# EAGLE design ioh-landscape (EAGLE 6.5.0)
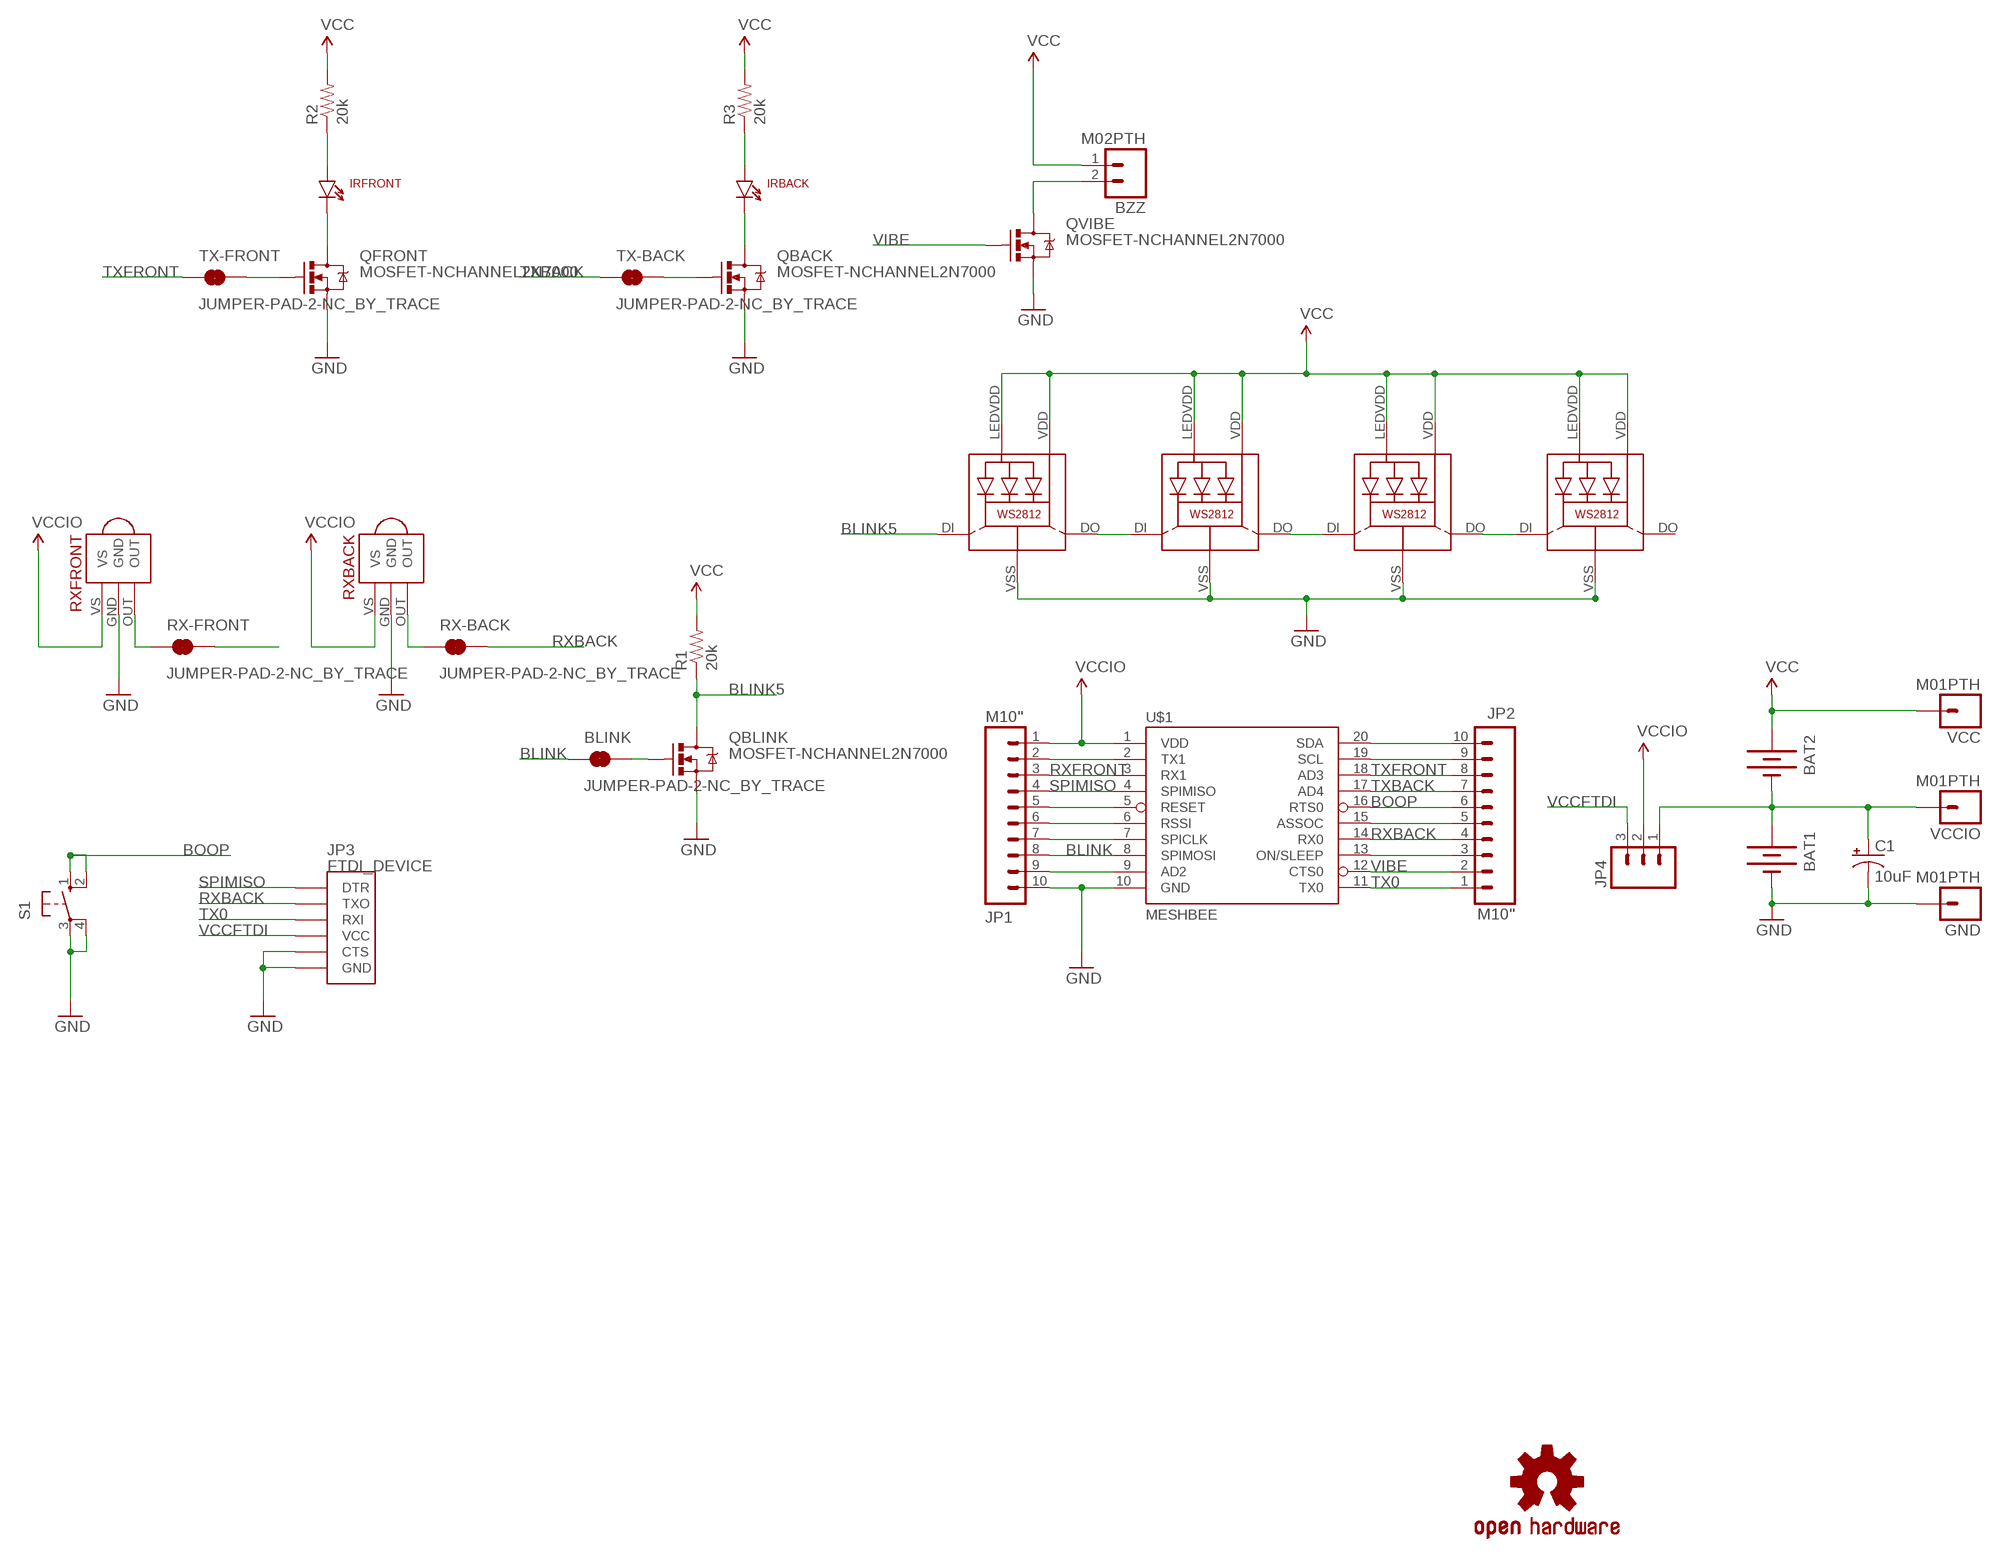
[diagram p0: schematic, sheet 1]

## Parts
BAT1  BATTERY20PTH  [BATTCOM_20MM_PTH]
BAT2  BATTERY20PTH  [BATTCOM_20MM_PTH]
BLINK  JUMPER-PAD-2-NC_BY_TRACE  [PAD-JUMPER-2-NC_BY_TRACE_YES_SILK]
BZZ  M02PTH  [1X02]
C1  10uF  10UF-25V-20%(PTH)KIT  [CPOL-RADIAL-10UF-25V-KIT]
GND  M01PTH  [1X01]
IRBACK  LTE-302  [LTE-302]
IRFRONT  LTE-302  [LTE-302]
JP1  M10"  [1X10]
JP2  M10"  [1X10]
JP3  FTDI_DEVICE  [FTDI_DEVICE_SIDE]
JP4  M03LOCK  [1X03_LOCK]
LED2  WS2812  [WS2812]
LED3  WS2812  [WS2812]
LED4  WS2812  [WS2812]
LED5  WS2812  [WS2812]
LOGO1  OSHW-LOGOS  [OSHW-LOGO-S]
QBACK  MOSFET-NCHANNEL2N7000  [TO-92]
QBLINK  MOSFET-NCHANNEL2N7000  [TO-92]
QFRONT  MOSFET-NCHANNEL2N7000  [TO-92]
QVIBE  MOSFET-NCHANNEL2N7000  [TO-92]
R1  20k  RESISTORPTH-1/4W  [AXIAL-0.4]
R2  20k  RESISTORPTH-1/4W  [AXIAL-0.4]
R3  20k  RESISTORPTH-1/4W  [AXIAL-0.4]
RX-BACK  JUMPER-PAD-2-NC_BY_TRACE  [PAD-JUMPER-2-NC_BY_TRACE_YES_SILK]
RX-FRONT  JUMPER-PAD-2-NC_BY_TRACE  [PAD-JUMPER-2-NC_BY_TRACE_YES_SILK]
RXBACK  TSOP2438  [TSOP2438]
RXFRONT  TSOP2438  [TSOP2438]
S1  40-XX  [B3F-40XX]
TX-BACK  JUMPER-PAD-2-NC_BY_TRACE  [PAD-JUMPER-2-NC_BY_TRACE_YES_SILK]
TX-FRONT  JUMPER-PAD-2-NC_BY_TRACE  [PAD-JUMPER-2-NC_BY_TRACE_YES_SILK]
U$1  MESHBEE  [MESHBEE]
VCC  M01PTH  [1X01]
VCCIO  M01PTH  [1X01]

## Nets
BLINK: BLINK.1 JP1.8 U$1.8(SPIMOSI)
BLINK5: LED2.DI QBLINK.3(D) R1.P$1
BOOP: JP2.6 S1.1(S) S1.2(S1) U$1.16(RTS0)
GND: BAT1.2(-) C1.2(-) GND.1 JP1.10 JP3.P$5(CTS) JP3.P$6(GND) LED2.VSS(GND) LED3.VSS(GND) LED4.VSS(GND) LED5.VSS(GND) QBACK.1(S) QBLINK.1(S) QFRONT.1(S) QVIBE.1(S) RXBACK.GND RXFRONT.GND S1.3(P) S1.4(P1) U$1.10(GND)
N$1: LED2.DO LED3.DI
N$2: LED3.DO LED4.DI
N$3: LED4.DO LED5.DI
N$4: IRFRONT.A R2.P$1
N$5: JP1.2 U$1.2(TX1)
N$6: BLINK.2 QBLINK.2(G)
N$8: JP1.5 U$1.5(RESET)
N$9: JP1.6 U$1.6(RSSI)
N$10: JP1.7 U$1.7(SPICLK)
N$11: IRFRONT.C QFRONT.3(D)
N$12: JP1.9 U$1.9(AD2)
N$13: BZZ.2 QVIBE.3(D)
N$14: BAT1.1(+) BAT2.2(-) C1.1(+) JP4.1 VCCIO.1
N$15: RX-BACK.1 RXBACK.OUT
N$16: JP2.3 U$1.13(ON/SLEEP)
N$17: RX-FRONT.1 RXFRONT.OUT
N$18: JP2.5 U$1.15(ASSOC)
N$20: QFRONT.2(G) TX-FRONT.2
N$21: QBACK.2(G) TX-BACK.2
N$22: JP2.9 U$1.19(SCL)
N$23: JP2.10 U$1.20(SDA)
N$24: IRBACK.A R3.P$1
N$25: IRBACK.C QBACK.3(D)
RXBACK: JP2.4 JP3.P$2(TXO) RX-BACK.2 U$1.14(RX0)
RXFRONT: JP1.3 RX-FRONT.2 U$1.3(RX1)
SPIMISO: JP1.4 JP3.P$1(DTR) U$1.4(SPIMISO)
TX0: JP2.1 JP3.P$3(RXI) U$1.11(TX0)
TXBACK: JP2.7 TX-BACK.1 U$1.17(AD4)
TXFRONT: JP2.8 TX-FRONT.1 U$1.18(AD3)
VCC: BAT2.1(+) BZZ.1 LED2.LEDVDD LED2.VDD LED3.LEDVDD LED3.VDD LED4.LEDVDD LED4.VDD LED5.LEDVDD LED5.VDD R1.P$2 R2.P$2 R3.P$2 VCC.1
VCCFTDI: JP3.P$4(VCC) JP4.3
VCCIO: JP1.1 JP4.2 RXBACK.VS RXFRONT.VS U$1.1(VDD)
VIBE: JP2.2 QVIBE.2(G) U$1.12(CTS0)
Unconnected: LED5.DO

## Library data of the parts
BAT1 BAT2 = SparkFun-Electromechanical:BATTERY: Battery Holders Various common sizes : AA, AAA, 20mm coin cell and 12mm coin cell. 20MM_4LEGS, BATT-10373
BLINK RX-BACK RX-FRONT TX-BACK TX-FRONT = SparkFun-Passives:JUMPER-PAD-2-NC_BY_TRACE
BZZ = SparkFun-Connectors:M02: Standard 2-pin 0.1" header. Use with - straight break away headers ( PRT-00116) - right angle break away headers (PRT-00553) - swiss pins (PRT-00743) - machine pins (PRT-00117) - female headers (PRT-00115) Molex polarized connector foot print use with: PRT-08233 with associated crimp pins and housings. 2.54_SCREWTERM for use with PRT-10571. 3.5mm Screw Terminal footprints for PRT-08084 5mm Screw Terminal footprints for use with PRT-08432
C1 = SparkFun-Capacitors:10UF-25V-20%(PTH): CAP-08440; PROD_ID: CAP-08440
GND VCC VCCIO = SparkFun-Connectors:M01: Header 1 Standard 1-pin 0.1" header. Use with straight break away headers (SKU : PRT-00116), right angle break away headers (PRT-00553), swiss pins (PRT-00743), machine pins (PRT-00117), and female headers (PRT-00115).
IRBACK IRFRONT = SparkFun-LED:LTE-302: Through-hole side-firing 940nm IR LED
JP1 JP2 = SparkFun-Connectors:M10: Header 10 Standard 10-pin 0.1" header. Use with straight break away headers (SKU : PRT-00116), right angle break away headers (PRT-00553), swiss pins (PRT-00743), machine pins (PRT-00117), and female headers (PRT-00115).
JP3 = SparkFun-Connectors:FTDI_DEVICE: Connector which mates to FTDI basic or FTDI cable.
JP4 = SparkFun-Connectors:M03: Header 3 Standard 3-pin 0.1" header. Use with straight break away headers (SKU : PRT-00116), right angle break away headers (PRT-00553), swiss pins (PRT-00743), machine pins (PRT-00117), and female headers (PRT-00115). Molex polarized connector foot print use with SKU : PRT-08232 with associated crimp pins and housings.
LED2-LED5 = adafruit:WS2812
LOGO1 = SparkFun-Aesthetics:OSHW-LOGO: Open Source Hardware Logo This logo indicates the piece of hardware it is found on incorporates a OSHW license and/or adheres to the definition of open source hardware found here: http://freedomdefined.org/OSHW
QBACK QBLINK QFRONT QVIBE = SparkFun-DiscreteSemi:MOSFET-NCHANNEL: Common NMOSFET Parts MFG P/N Store ID Prod ID FDD8780 TRANS-09984 SI7820DN TRANS-11055 FDS6630A IC-08089 2N7002PW TRANS-11151 FQP30N06L COM-10213 TRANS-10060 BSS123LT1G TRANS-08345 BSS138 TRANS-00830 BS170 2N7000
R1-R3 = SparkFun-Resistors:RESISTOR: Resistor Basic schematic elements and footprints for 0603, 1206, and PTH resistors.
RXBACK RXFRONT = ioh-1:TSOP2438
S1 = adafruit:40-XX: OMRON SWITCH; MF: OMRON COMPONENTS USA; MPN: B3F-4000; OC_FARNELL: 176434; OC_NEWARK: 36K3105
U$1 = ioh-1:MESHBEE: meshbee module

## Board
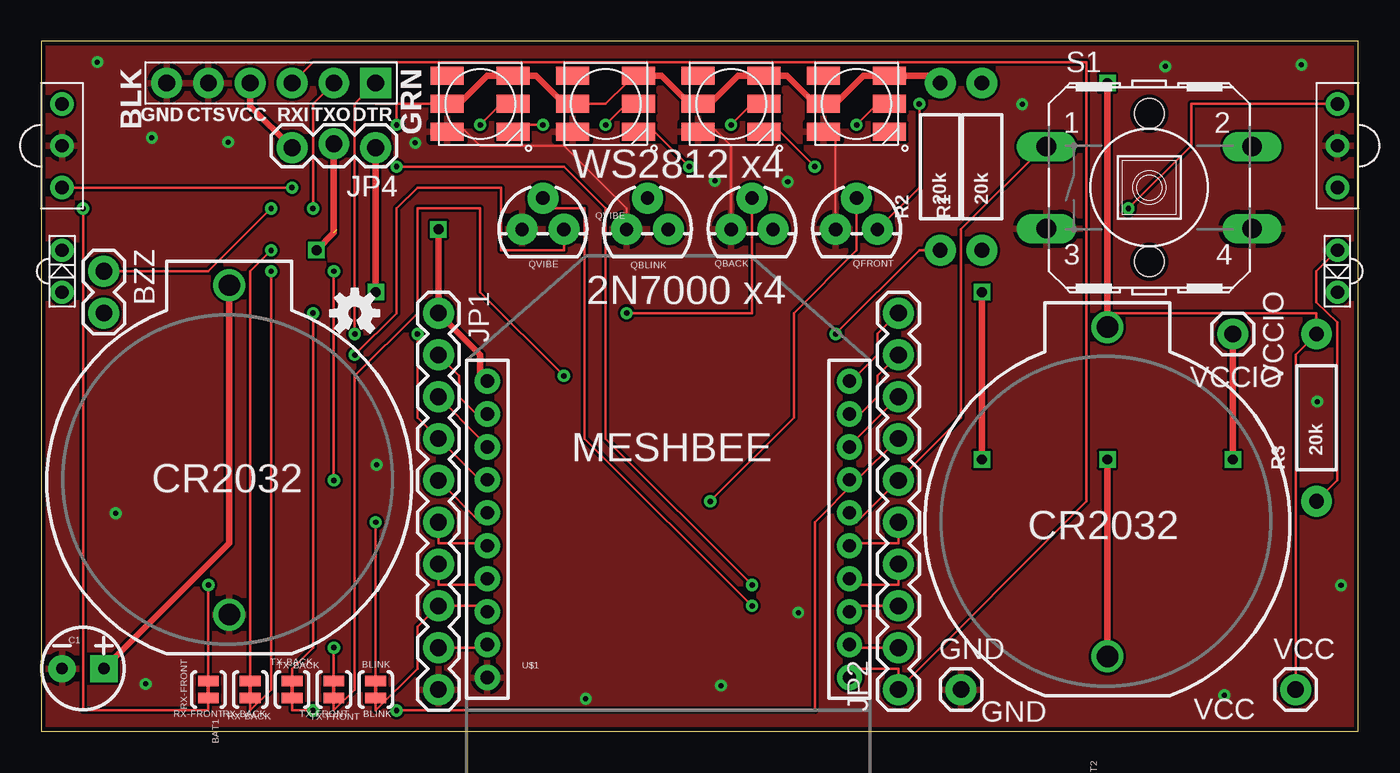
[diagram p1: board, top side]
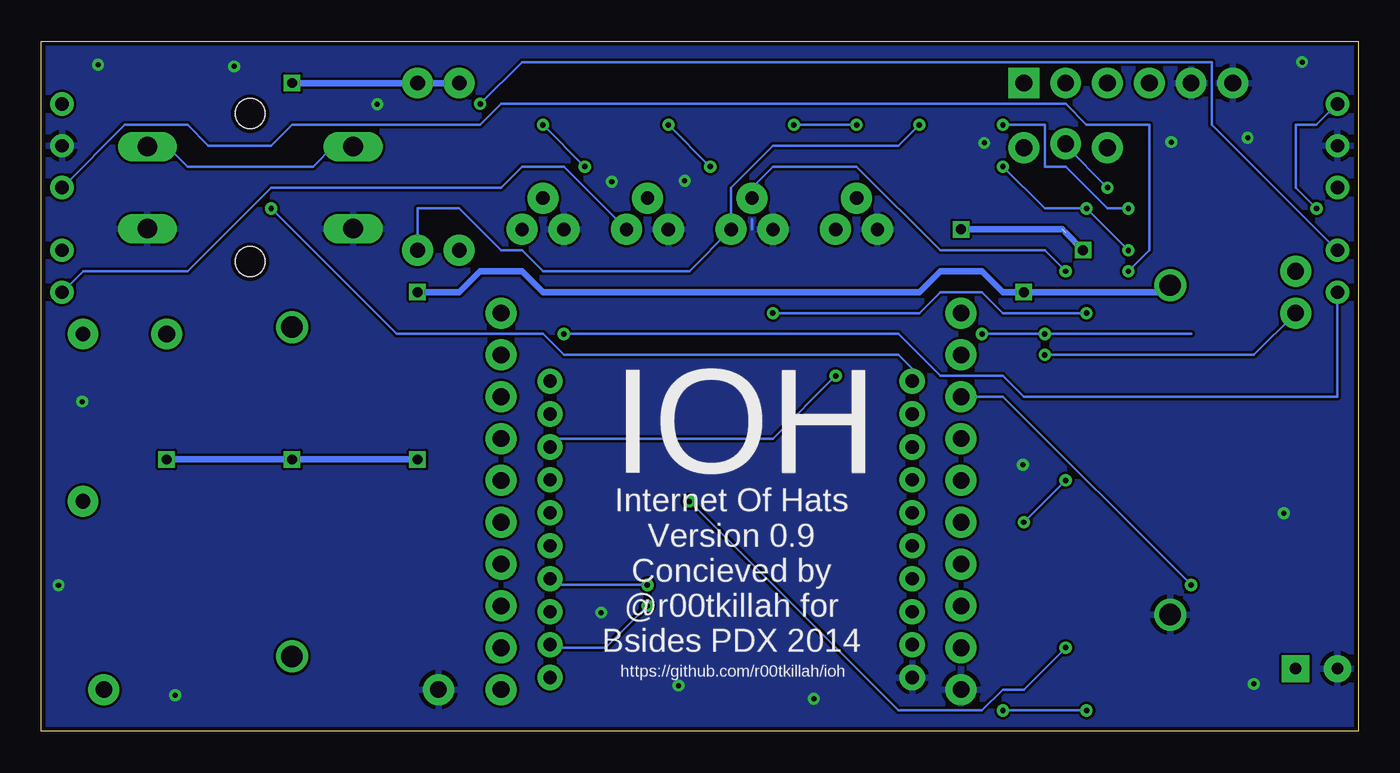
[diagram p2: board, bottom side, seen from below]

Size 80.01 x 41.91 mm. Coordinates in mm from the lower left corner, seen from the top.
Outline: 0,0 80.01,0 80.01,41.91 0,41.91 0,0
Copper layers (1*16): Top 0.035mm / dielectric 1.5mm / Bottom 0.035mm
Design rules "DFRobot_Eagle_Rule_v0.4": minimum track width 6mil, minimum drill 12mil, track to track 6mil, track to pad 6mil, pad to pad 6mil, via to via 6mil, smd to smd 0mil, copper to edge 10mil, drill to drill 10mil, minimum pad ring 12mil, minimum via ring 8mil, stop-mask expansion 2mil, vias tented up to drill 25mil, thermal gap 10mil

### Footprints (pad centres in the part's own frame; a part is rotated, then mirrored left to right if it is on the bottom)
BATTCOM_20MM_PTH = drill 1.3: 1 11.85,0; 2 -8.15,0
PAD-JUMPER-2-NC_BY_TRACE_YES_SILK = smd 0.635 x 1.27: 1 -0.508,0; 2 0.508,0
1X02 = drill 1.016 pad 1.88: 1 0,0; 2 2.54,0
CPOL-RADIAL-10UF-25V-KIT = drill 0.7 pad 1.651 square: 1 1.27,0 | drill 0.7 pad 1.651: 2 -1.27,0
1X01 = drill 1.016 pad 1.88: 1 0,0
LTE-302 = drill 0.8: A 1.27,0; C -1.27,0
1X10 = drill 1.016 pad 1.88: 1 0,0; 2 2.54,0; 3 5.08,0; 4 7.62,0; 5 10.16,0; 6 12.7,0; 7 15.24,0; 8 17.78,0; 9 20.32,0; 10 22.86,0
FTDI_DEVICE_SIDE = drill 1.016 pad 1.88 square: P$1 -6.35,0 | drill 1.016 pad 1.88: P$2 -3.81,0; P$3 -1.27,0; P$4 1.27,0; P$5 3.81,0; P$6 6.35,0
1X03_LOCK = drill 1.016 pad 1.88: 1 0,0.127; 2 2.54,-0.127; 3 5.08,0.127
WS2812 = smd 2 x 1.1: DI 2,0; DO 2,-1.7; LEDVDD -2,0; NC -2,1.7; VDD 2,1.7; VSS -2,-1.7
TO-92 = drill 0.813 pad 1.88: 1 -1.27,0; 2 0,1.905; 3 1.27,0
AXIAL-0.4 = drill 0.9 pad 1.88: P$1 -5.08,0; P$2 5.08,0
TSOP2438 = drill 0.8: GND 0,0; OUT -2.54,0; VS 2.54,0
B3F-40XX = drill 1.194 long: 1 -6.248,2.489; 2 6.248,2.489; 3 -6.248,-2.489; 4 6.248,-2.489 | hole 1.803: 0,-4.496; 0,4.496
MESHBEE = drill 0.8 pad 1.524: 1 -11,8.57; 2 -11,6.57; 3 -11,4.57; 4 -11,2.57; 5 -11,0.57; 6 -11,-1.43; 7 -11,-3.43; 8 -11,-5.43; 9 -11,-7.43; 10 -11,-9.43; 11 11,-9.43; 12 11,-7.43; 13 11,-5.43; 14 11,-3.43; 15 11,-1.43; 16 11,0.57; 17 11,2.57; 18 11,4.57; 19 11,6.57; 20 11,8.57

### Placement (x,y rotation side)
BAT1  11.43,15.24 90 top
BAT2  64.77,12.7 90 top
BLINK  20.32,2.54 90 top
BLINK  20.32,2.54 90 top
BZZ  3.81,27.94 270 top
BZZ  3.81,27.94 270 top
C1  2.54,3.81 0 top
GND  55.88,2.54 0 top
GND  55.88,2.54 0 top
IRBACK  78.74,27.94 90 top
IRFRONT  1.27,27.94 270 top
JP1  24.13,25.4 270 top
JP2  52.07,2.54 90 top
JP3  13.97,39.37 180 top
JP3  13.97,39.37 180 top
JP4  20.32,35.56 180 top
JP4  20.32,35.56 180 top
LED2  26.67,38.1 0 top
LED3  34.29,38.1 0 top
LED4  41.91,38.1 0 top
LED5  49.53,38.1 0 top
LOGO1  19.05,25.4 0 top
LOGO1  19.05,25.4 0 top
QBACK  43.18,30.48 0 top
QBLINK  36.83,30.48 0 top
QFRONT  49.53,30.48 0 top
QVIBE  30.48,30.48 0 top
QVIBE  30.48,30.48 0 top
R1  57.15,34.29 90 top
R2  54.61,34.29 90 top
R3  77.47,19.05 90 top
RX-BACK  12.7,2.54 90 top
RX-BACK  12.7,2.54 90 top
RX-FRONT  10.16,2.54 90 top
RX-FRONT  10.16,2.54 90 top
RXBACK  78.74,35.56 90 top
RXFRONT  1.27,35.56 270 top
S1  67.31,33.02 0 top
TX-BACK  15.24,2.54 90 top
TX-BACK  15.24,2.54 90 top
TX-FRONT  17.78,2.54 90 top
TX-FRONT  17.78,2.54 90 top
U$1  38.1,12.7 0 top
U$2  [BSIDES]  2.48,29.56 0 top
VCC  76.2,2.54 0 top
VCC  76.2,2.54 0 top
VCCIO  72.39,24.13 0 top
VCCIO  72.39,24.13 0 top

### Tracks (layer width: path | path; a pad name or v marks a point on that pad's centre or on a via)
BLINK
  Top 0.152: BLINK.1 20.32,1.27 22.86,3.81 22.86,6.35 JP1.8 26.67,7.62 U$1.8
BLINK5  (via drill 0.33)
  Top 0.152: v26.67,36.83 27.94,38.1 LED2.DI
  Bottom 0.152: v26.67,36.83 27.94,35.56 35.56,35.56 38.1,33.02 QBLINK.3 40.64,27.94 49.53,27.94 50.8,29.21 52.07,29.21 54.61,31.75 57.15,31.75 R1.P$1
BOOP
  Top 0.152: U$1.16 49.53,12.7 JP2.6 55.88,19.05 55.88,30.48 60.96,35.56 S1.1
  Bottom 0.152: S1.2 72.39,35.56 71.12,34.29 63.5,34.29 62.23,35.56 S1.1
GND  (via drill 0.31)
  Top 0.152: 31.75,35.56 26.67,35.56 25.4,36.83 LED2.VSS | 31.75,35.56 31.75,36.83 LED3.VSS | QBACK.1 41.91,35.56 40.64,36.83 LED4.VSS | QFRONT.1 48.26,36.83 LED5.VSS | 31.75,35.56 35.56,31.75 QBLINK.1
  Bottom 0.152: RXFRONT.GND
  other vias: 4.53,13.25 6.35,2.88 33.08,1.98 41.29,2.78 45.99,7.21 71.86,2.19 78.96,8.87 76.56,40.48 68.29,40.38 59.59,38.08 45.35,33.38 40.92,33.43 22.73,35.73 11.36,35.78 6.72,36.05 3.41,40.64 20.38,16.18 77.52,20.03
  pour Bottom: 80.01,0 0,0 0,41.91 80.01,41.91
  pour Top: 0,41.91 0,0 80.01,0 80.01,41.91
N$1  (via drill 0.33)
  Top 0.152: v30.48,36.83 29.21,36.83 LED2.DO | v34.29,36.83 35.56,38.1 LED3.DI
  Bottom 0.152: v34.29,36.83 v30.48,36.83
N$2  (via drill 0.33)
  Top 0.152: v39.37,34.29 36.83,36.83 LED3.DO | v41.91,36.83 43.18,38.1 LED4.DI
  Bottom 0.152: v41.91,36.83 v39.37,34.29
N$3  (via drill 0.33)
  Top 0.152: v46.99,34.29 44.45,36.83 LED4.DO | v49.53,36.83 50.8,38.1 LED5.DI
  Bottom 0.152: v49.53,36.83 v46.99,34.29
N$4  (via drill 0.33)
  Top 0.152: v48.26,24.13 53.34,29.21 R2.P$1
  Bottom 0.152: IRFRONT.A 1.27,20.32 20.32,20.32 21.59,21.59 25.4,21.59 27.94,24.13 v48.26,24.13
N$5
  Top 0.152: JP1.2 25.4,21.59 25.4,20.32 26.67,19.05 U$1.2
N$6  (via drill 0.33)
  Top 0.152: v20.32,12.7 BLINK.2 | v17.78,27.94 v17.78,15.24
  Bottom 0.152: v17.78,15.24 v20.32,12.7 | v17.78,27.94 19.05,29.21 25.4,29.21 30.48,34.29 35.56,34.29 36.83,33.02 QBLINK.2
N$7
  Bottom 0.152: 36.83,30.48 36.83,31.09
  pour Bottom: 0.11,41.96 0.11,0.05 80.12,0.05 80.12,41.96
N$8
  Top 0.152: JP1.5 26.67,12.7 U$1.5
N$9
  Top 0.152: JP1.6 24.13,11.43 26.67,11.43 U$1.6
N$10
  Top 0.152: JP1.7 24.13,8.89 26.67,8.89 U$1.7
N$11  (via drill 0.33)
  Top 0.152: v53.34,38.1 53.34,33.02 QFRONT.3
  Bottom 0.152: IRFRONT.C 8.89,36.83 8.89,40.64 50.8,40.64 v53.34,38.1
N$12
  Top 0.152: JP1.9 26.67,5.08 U$1.9
N$13  (via drill 0.33)
  Top 0.152: v19.05,22.86 21.59,25.4 21.59,31.75 22.86,33.02 27.94,33.02 27.94,29.21 31.75,29.21 QVIBE.3
  Bottom 0.152: BZZ.2 6.35,22.86 v19.05,22.86
N$14  (via drill 0.6)
  Top 0.406: BAT1.1 11.43,11.43 C1.1 | BAT2.2 v64.77,16.51 | VCCIO.1 v72.39,16.51 | v57.15,16.51 v57.15,26.67 | JP4.1 v20.32,26.67
  Bottom 0.406: v72.39,16.51 v64.77,16.51 v57.15,16.51 | v57.15,26.67 54.61,26.67 53.34,27.94 50.8,27.94 49.53,26.67 26.67,26.67 25.4,27.94 22.86,27.94 21.59,26.67 v20.32,26.67 11.85,26.67 BAT1.1
N$15  (via drill 0.33)
  Top 0.152: RX-BACK.1 12.7,1.27 13.97,2.54 v13.97,27.94
  Bottom 0.152: v13.97,27.94 12.7,29.21 12.7,36.83 16.51,36.83 17.78,38.1 52.07,38.1 53.34,36.83 64.77,36.83 66.04,35.56 69.85,35.56 71.12,36.83 74.93,36.83 RXBACK.OUT
N$16
  Top 0.152: JP2.3 49.53,7.62 U$1.13
N$17  (via drill 0.33)
  Top 0.152: RX-FRONT.1 10.16,1.27 2.54,1.27 v2.54,31.75
  Bottom 0.152: v2.54,31.75 3.81,33.02 3.81,36.83 2.54,36.83 RXFRONT.OUT
N$18
  Top 0.152: JP2.5 52.07,11.43 49.53,11.43 U$1.15
N$20  (via drill 0.33)
  Top 0.152: v17.78,5.08 TX-FRONT.2 | v40.64,13.97 45.72,19.05 45.72,25.4 49.53,29.21 QFRONT.2
  Bottom 0.152: v17.78,5.08 20.32,2.54 21.59,2.54 22.86,1.27 27.94,1.27 v40.64,13.97
N$21  (via drill 0.33)
  Top 0.152: TX-BACK.2 15.24,3.81 16.51,5.08 v16.51,25.4 | v35.56,25.4 43.18,25.4 QBACK.2
  Bottom 0.152: v16.51,25.4 21.59,25.4 22.86,26.67 25.4,26.67 26.67,25.4 v35.56,25.4
N$22
  Top 0.152: JP2.9 50.8,21.59 50.8,20.32 49.53,19.05 U$1.19
N$23
  Top 0.152: JP2.10 50.8,24.13 50.8,22.86 49.53,21.59 U$1.20
N$24
  Top 0.152: IRBACK.A 77.47,27.94 77.47,26.07 78.73,24.83 78.74,15.24 R3.P$1
N$25
  Bottom 0.152: IRBACK.C 77.47,27.94 71.12,27.94 66.04,33.02 52.07,33.02 50.8,34.29 48.26,34.29 QBACK.3
RXBACK  (via drill 0.33)
  Top 0.152: JP2.4 52.07,8.89 49.53,8.89 U$1.14 | RX-BACK.2 12.7,27.94 v13.97,29.21 | v16.51,31.75 16.51,38.1 JP3.P$2 | v43.18,8.89 34.29,17.78 34.29,31.75 31.75,34.29 v21.59,34.29
  Bottom 0.152: v13.97,29.21 v16.51,31.75 19.05,31.75 v21.59,34.29 | v43.18,8.89 49.53,8.89 U$1.14
RXFRONT  (via drill 0.33)
  Top 0.152: v10.16,8.89 RX-FRONT.2 | JP1.3 26.67,17.78 U$1.3
  Bottom 0.152: v10.16,8.89 21.59,20.32 JP1.3
SPIMISO  (via drill 0.33)
  Top 0.152: U$1.4 26.67,15.24 JP1.4 22.86,19.05 v22.86,24.13 | JP3.P$1 19.05,38.1 v19.05,24.13
  Bottom 0.152: v22.86,24.13 v19.05,24.13 10.16,24.13
TX0
  Top 0.152: U$1.11 49.53,3.81 52.07,3.81 JP2.1 63.5,13.97 63.5,40.64 16.51,40.64 JP3.P$3
TXBACK  (via drill 0.33)
  Top 0.152: TX-BACK.1 15.24,1.27 v16.51,1.27 | v21.59,1.27 46.99,1.27 46.99,12.7 49.53,15.24 | 49.53,15.24 JP2.7 | 49.53,15.24 U$1.17
  Bottom 0.152: v21.59,1.27 v16.51,1.27
TXFRONT  (via drill 0.33)
  Top 0.152: TX-FRONT.1 17.78,1.27 19.05,2.54 19.05,21.59 22.86,25.4 22.86,31.75 26.67,31.75 26.67,26.67 v31.75,21.59 | JP2.8 49.53,17.78 U$1.18
  Bottom 0.152: v31.75,21.59 35.56,17.78 49.53,17.78 U$1.18
VCC  (via drill 0.33, 0.6)
  Top 0.152: 25.4,38.1 LED2.LEDVDD 21.59,38.1 | 31.75,38.1 LED3.LEDVDD 34.29,38.1 35.56,39.37 LED3.VDD | 21.59,38.1 20.32,38.1 | 40.64,38.1 LED4.LEDVDD 39.37,38.1 | 46.99,38.1 LED5.LEDVDD 48.26,38.1 | VCC.1 76.2,22.86 R3.P$2 77.47,25.4 64.77,25.4 | BZZ.1 10.16,27.94 v13.97,31.75 | 21.59,38.1 v21.59,36.83
  Top 0.406: 48.26,38.1 49.96,39.8 LED5.VDD 54.18,39.8 R2.P$2 | 40.64,38.1 42.34,39.8 LED4.VDD 45.29,39.8 46.99,38.1 | 25.4,38.1 27.1,39.8 LED2.VDD 30.05,39.8 31.75,38.1 | LED3.VDD 37.67,39.8 39.37,38.1 | BAT2.1 64.77,25.4 v64.77,39.37
  Bottom 0.152: v13.97,31.75 15.24,31.75 17.78,34.29 19.05,34.29 19.05,36.83 v21.59,36.83
  Bottom 0.406: R2.P$2 R1.P$2 v64.77,39.37
VCCFTDI
  Top 0.406: JP3.P$4 12.7,37.97 JP4.3
VCCIO  (via drill 0.33, 0.6)  (1 unrouted)
  Top 0.152: v15.24,33.02 RXFRONT.VS | RXBACK.VS 69.85,38.1 69.85,35.56 v66.04,31.75
  Top 0.406: v24.13,30.48 JP1.1 26.67,22.86 26.67,21.7 U$1.1 | v16.73,29.23 17.78,30.27 JP4.2
  Bottom 0.152: v15.24,33.02 17.78,35.56 JP4.2 | v66.04,31.75 58.42,24.13 49.53,24.13 48.26,22.86 27.94,22.86 26.67,21.59 U$1.1
  Bottom 0.406: 17.78,30.27 v16.73,29.23 | 17.99,30.48 v24.13,30.48
VIBE  (via drill 0.33)
  Top 0.152: JP2.2 49.53,5.08 U$1.12 | v43.18,7.62 33.02,17.78 33.02,31.75 30.48,31.75 QVIBE.2
  Bottom 0.152: v43.18,7.62 45.72,5.08 49.53,5.08 U$1.12

### Text on the board
tNames: WS2812 x4 | 2N7000 x4 | MESHBEE | CR2032 | CR2032
bNames: IOH | Internet Of Hats / Version 0.9 / Concieved by / @r00tkillah for / Bsides PDX 2014 | https://github.com/r00tkillah/ioh